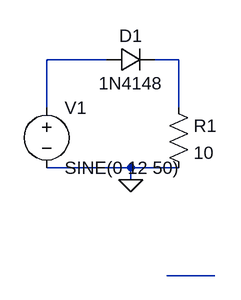
[diagram p0: schematic Draft1.asc]
Draft1.asc, the LTspice schematic file:
Version 4
SHEET 1 880 680
WIRE 400 336 320 336
WIRE 496 336 464 336
WIRE 320 400 320 336
WIRE 496 400 496 336
WIRE 432 480 320 480
WIRE 496 480 432 480
WIRE 432 496 432 480
WIRE 544 624 480 624
FLAG 432 496 0
SYMBOL voltage 320 384 R0
SYMATTR InstName V1
SYMATTR Value SINE(0 12 50)
SYMBOL diode 400 352 R270
WINDOW 0 32 32 VTop 2
WINDOW 3 0 32 VBottom 2
SYMATTR InstName D1
SYMATTR Value 1N4148
SYMBOL res 480 384 R0
SYMATTR InstName R1
SYMATTR Value 10

The netlist it stands for:
* Draft1.asc
V1 N001 0 SINE(0 12 50)
D1 N001 N002 1N4148
R1 N002 0 10
.model D D
.lib standard.dio
.backanno
.end